# Altium schematic sheet Communication.SchDoc
size A4; SheetNumber: 4; SheetTotal: 5
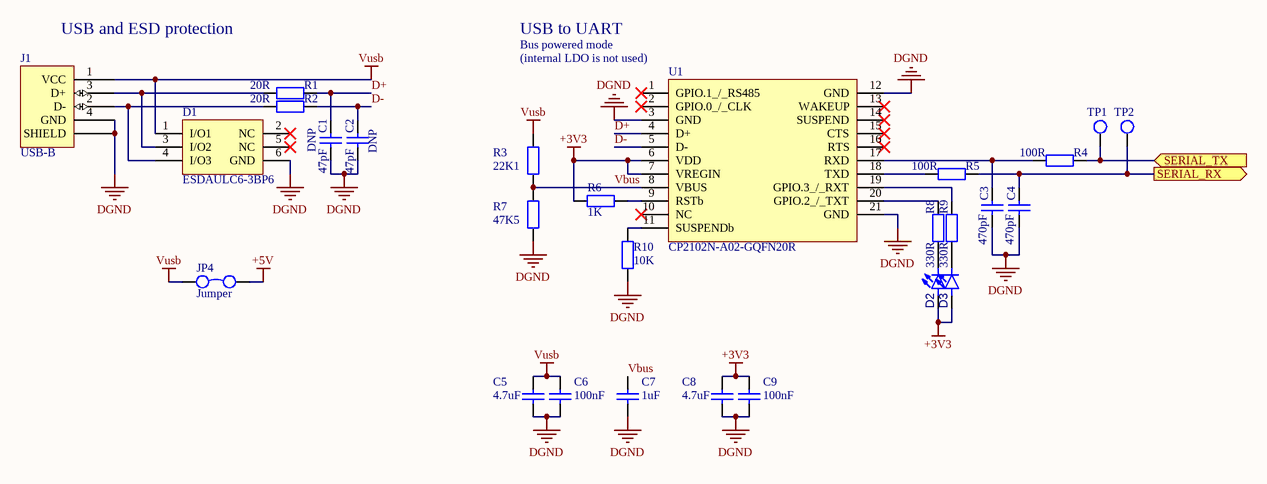
[diagram p0: Communication.SchDoc]

## Parts
C1  DNP  value 47pF  [CAP0603]
C2  DNP  value 47pF  [CAP0603]
C3  470pF  [CAP0603]
C4  470pF  [CAP0603]
C5  4.7uF  [CAP0603]
C6  100nF  [CAP0603]
C7  1uF  [CAP0603]
C8  4.7uF  [CAP0603]
C9  100nF  [CAP0603]
D1  ESDAULC6-3BP6  [SOT-666]
D2  (no value)  [LED0603]
D3  (no value)  [LED0603]
J1  USB-B  [USB-B-FEMALE]
JP4  Jumper  [PIN-1X2]
R1  20R  [RES0603]
R2  20R  [RES0603]
R3  22K1  [RES0603]
R4  100R  [RES0603]
R5  100R  [RES0603]
R6  1K  [RES0603]
R7  47K5  [RES0603]
R8  330R  [RES0603]
R9  330R  [RES0603]
R10  10K  [RES0603]
TP1  Test Point  [TP-1.5HOLE]  (value not drawn)
TP2  Test Point  [TP-1.5HOLE]  (value not drawn)
U1  CP2102N-A02-GQFN20R  [QFN-20]

## Ports
SERIAL_RX (out, see Main[2B], uC[1B]), SERIAL_TX (in, see Main[2B], uC[1B])

## Nets
+3V3: C8.2 C9.1 D2.2(A) D3.2(A) R6.1 U1.6(VDD) U1.7(VREGIN)
+5V: JP4.2
DGND: C1.1 C2.1 C3.1 C4.1 C5.1 C6.2 C7.1 C8.1 C9.2 D1.6(GND) J1.0(SHIELD) J1.4(GND) R7.1 R10.1 U1.3(GND) U1.12(GND) U1.21(GND)
Vusb: C5.2 C6.1 D1.1(I/O1) J1.1(VCC) JP4.1 R3.2
D+: C1.2 R1.1 U1.4(D+)
D-: C2.2 R2.1 U1.5(D-)
SERIAL_RX: C4.2 R5.2 TP2.1 ; port SERIAL_RX
SERIAL_TX: R4.2 TP1.1 ; port SERIAL_TX
Vbus: C7.2 R3.1 R7.2 U1.8(VBUS)
NetC3_2: C3.2 R4.1 U1.17(RXD)
NetD1_3: D1.3(I/O2) J1.3(D+) R1.2
NetD1_4: D1.4(I/O3) J1.2(D-) R2.2
NetD2_1: D2.1(K) R8.2
NetD3_1: D3.1(K) R9.2
NetR5_1: R5.1 U1.18(TXD)
NetR6_2: R6.2 U1.9(RSTb)
NetR8_1: R8.1 U1.20(GPIO.2_/_TXT)
NetR9_1: R9.1 U1.19(GPIO.3_/_RXT)
NetR10_2: R10.2 U1.11(SUSPENDb)

Not connected (* = marked no-connect by the designer): D1 2(NC)* 5(NC)*; U1 1(GPIO.1_/_RS485)* 2(GPIO.0_/_CLK)* 10(NC)* 13(WAKEUP)* 14(SUSPEND)* 15(CTS)* 16(RTS)*

## Notes on the sheet
- USB and ESD protection
- USB to UART
- Bus powered mode
- (near U1) (internal LDO is not used)

## Library data of the parts
C1 C2 = 47pF: Ceramic Capacitor, Multilayer, Ceramic, 100V, 5% +Tol, 5% -Tol, C0G, 30ppm/Cel TC, 0.000047uF, Surface Mount, 0603; Manufacturer: KEMET; Manufacturer Part Number: C0603C470J1GACTU; Multilayer: Yes; Voltage: *; Supplier: Mouser; Supplier Part Number: 80-C0603C470J1G; RoHS: Yes; Category: Ceramic Capacitors; Stock: 43381; Pricing: 1=0.1, 10=0.026, 50=0.026, 100=0.016, 1000=0.012, 10000=0.007 (USD); Mounting Technology: Surface Mount; Pins: 2; Dielectric Material: Ceramic; Package Shape: Rectangular; Case/Package: 0603; Terminal Finish: Nickel; Min Operating Temperature: -55°C; Max Operating Temperature: 125°C; JESD-609 Code: e3; Capacitor Type: Ceramic; Tolerance  (fill in as +-): 5%; Package Style: SMTMeter; Packaging: Tape and Reel; Tolerance (fill in as +-): 5%; Rated DC Voltage (URdc): 100V; Temperature Characteristics Code: C0G; Termination: Wraparound; Length: 1.6mm; Width: 0.8mm; Height: 0.8mm; Reach SVHC Compliant: Yes; RoHS Compliant: Yes; ComponentLink1URL: https://datasheet.ciiva.com:443/pdfs/VipMasterIC/IC/KEME/KEME-S-A0005605168/KEME-S-A0005605168-1.pdf?src-supplier=IHS+Markit; ComponentLink1Description: https://datasheet.ciiva.com:443/pdfs/VipMasterIC/IC/KEME/KEME-S-A0005605168/KEME-S-A0005605168-1.pdf?src-supplier=IHS+Markit; ComponentLink2URL: https://datasheet.ciiva.com/28668/1789732-28668693.pdf?src-supplier=Element14; ComponentLink2Description: https://datasheet.ciiva.com/28668/1789732-28668693.pdf?src-supplier=Element14; ComponentLink3URL: https://datasheet.ciiva.com/18193/getdatasheetpartid-544691-18193046.pdf?src-supplier=Verical; ComponentLink3Description: https://datasheet.ciiva.com/18193/getdatasheetpartid-544691-18193046.pdf?src-supplier=Verical; ComponentLink4URL: https://datasheet.ciiva.com/18101/getdatasheetpartid-38001-18101098.pdf?src-supplier=Verical; ComponentLink4Description: https://datasheet.ciiva.com/18101/getdatasheetpartid-38001-18101098.pdf?src-supplier=Verical
C3 C4 = 470pF: Ceramic Capacitor, Multilayer, Ceramic, 250V, 5% +Tol, 5% -Tol, C0G, 30ppm/Cel TC, 0.00047uF, Surface Mount, 0603; Manufacturer: KEMET; Manufacturer Part Number: C0603C471JAGACAUTO; Multilayer: Yes; Reference Standard: AEC-Q200; Supplier: Mouser; Supplier Part Number: 80-C0603C471JAGAUTO; RoHS: Yes; Category: Ceramic Capacitors; Stock: 51887; Pricing: 1=0.1, 10=0.068, 50=0.068, 100=0.034, 1000=0.022, 10000=0.017 (USD); Pins: 2; Dielectric Material: Ceramic; Case/Package: 0603; Terminal Finish: Nickel; Min Operating Temperature: -55°C; Max Operating Temperature: 125°C; JESD-609 Code: e3; Capacitor Type: Ceramic; Tolerance  (fill in as +-): 5%; Package Style: SMTMeter; Packaging: Tape and Reel; Tolerance (fill in as +-): 5%; Rated DC Voltage (URdc): 250V; Temperature Characteristics Code: C0G; Length: 1.6mm; Width: 0.8mm; Height: 0.8mm; Reach SVHC Compliant: Yes; RoHS Compliant: Yes; ComponentLink1URL: https://datasheet.ciiva.com:443/pdfs/VipMasterIC/IC/KEME/KEME-S-A0008958445/KEME-S-A0008958445-1.pdf?src-supplier=IHS+Markit; ComponentLink1Description: https://datasheet.ciiva.com:443/pdfs/VipMasterIC/IC/KEME/KEME-S-A0008958445/KEME-S-A0008958445-1.pdf?src-supplier=IHS+Markit; ComponentLink2URL: http://www.mouser.com/ds/2/212/KEM_C1086_U2J-962528.pdf?src-supplier=Mouser; ComponentLink2Description: http://www.mouser.com/ds/2/212/KEM_C1086_U2J-962528.pdf?src-supplier=Mouser; ComponentLink3URL: http://www.kemet.com/Lists/ProductCatalog/Attachments/420/KEM_C1022_C0G_AUTO_SMD.pdf?src-supplier=Digikey; ComponentLink3Description: http://www.kemet.com/Lists/ProductCatalog/Attachments/420/KEM_C1022_C0G_AUTO_SMD.pdf?src-supplier=Digikey; ComponentLink4URL: https://api.kemet.com/component-edge/download/datasheet/C0603C471JAGACAUTO.pdf?src-supplier=Digikey; ComponentLink4Description: https://api.kemet.com/component-edge/download/datasheet/C0603C471JAGACAUTO.pdf?src-supplier=Digikey; Value: 470pF
C5 C8 = 4.7uF: Capacitor; Voltage: *; Value: 4.7uF
C6 C9 = 100nF: Capacitor; Voltage: *; Value: 100nF
C7 = 1uF: Capacitor; Voltage: *; Value: 1uF
D1 = ESDAULC6-3BP6: TVS Diode (Bi-directional); Manufacturer_Name: STMicroelectronics; Datasheet Link: https://www.st.com/resource/en/datasheet/esdaulc6-3bp6.pdf; Height: 0.6mm; Manufacturer_Part_Number: ESDAULC6-3BP6; Mouser Part Number: 511-ESDAULC63BP6; Mouser Price/Stock: https://www.mouser.co.uk/ProductDetail/STMicroelectronics/ESDAULC6-3BP6?qs=eU2TTeT5rM3P6hIT2KJeMw%3D%3D; Arrow Part Number: ESDAULC6-3BP6; Arrow Price/Stock: https://www.arrow.com/en/products/esdaulc6-3bp6/stmicroelectronics?region=europe
D2 D3 = LED Green: Single Color LED, Bright Green, Water Clear, 1.1mm; Manufacturer: Wurth Electronics; Manufacturer Part Number: 150060VS75000; Shape: Rectangular; Forward Current: 30mA; Luminous Intensity-Nom: 40mcd; Channels: 1; Viewing Angle: 140°; Overall Height: 0.7mm; Supplier: Mouser; Supplier Part Number: 710-150060VS75000; RoHS: Yes; Category: LEDs; Stock: 96633; Pricing: 1=0.15, 10=0.15, 50=0.142, 100=0.122, 1000=0.116, 10000=0.116 (USD); Mounting Technology: Surface Mount; Pins: 2; Color: Green; Min Operating Temperature: -40°C; Max Operating Temperature: 85°C; Lens Style: WATER CLEAR; Optoelectronic Device Type: SINGLE COLOR LED; Packaging: Tape and Reel; Size: 1.1mm; Terminal Pitch: 1.6mm; Reach SVHC Compliant: Yes; RoHS Compliant: Yes; ComponentLink1URL: https://datasheet.ciiva.com:443/pdfs/VipMasterIC/IC/MIDC/MIDC-S-A0007768636/MIDC-S-A0007768636-1.pdf?src-supplier=IHS+Markit; ComponentLink1Description: https://datasheet.ciiva.com:443/pdfs/VipMasterIC/IC/MIDC/MIDC-S-A0007768636/MIDC-S-A0007768636-1.pdf?src-supplier=IHS+Markit; ComponentLink2URL: https://datasheet.ciiva.com/29562/150060vs75000-29562919.pdf?src-supplier=Digikey; ComponentLink2Description: https://datasheet.ciiva.com/29562/150060vs75000-29562919.pdf?src-supplier=Digikey
J1 = USB-B: USB Connector
JP4 = Jumper: 2 pin jumper connection
R1 R2 = 20R: Resistor; Value: 20R
R3 = 22K1: Resistor; Value: 22K1
R4 R5 = 100R: Resistor; Value: 100R
R6 = 1K: Resistor; Value: 1K
R7 = 47K5: Resistor; Value: 47K5
R8 R9 = 330R: Resistor; Value: 330R
R10 = 10K: Resistor; Value: 10K
U1 = CP2102N-A02-GQFN20R: USB-UART Bridge; Manufacturer_Name: Silicon Labs; Datasheet Link: https://www.silabs.com/documents/public/data-sheets/cp2102n-datasheet.pdf; Height: 0.8mm; Manufacturer_Part_Number: CP2102N-A02-GQFN20R; Mouser Part Number: 634-CP2102NA02QFN20R; Mouser Price/Stock: https://www.mouser.co.uk/ProductDetail/Silicon-Labs/CP2102N-A02-GQFN20R?qs=u16ybLDytRbf2uwPkMBdUg%3D%3D; Arrow Part Number: CP2102N-A02-GQFN20R; Arrow Price/Stock: https://www.arrow.com/en/products/cp2102n-a02-gqfn20r/silicon-labs?utm_currency=USD&region=nac